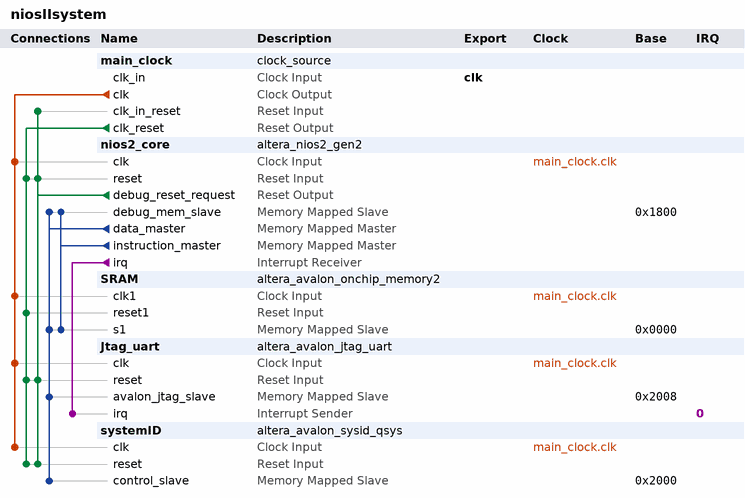
[diagram p0: system contents]
# Platform Designer (Qsys) system niosIIsystem, Cyclone V 5CEBA4F23C7
# Parameters at their usual value, and those the tool derives, are not listed.
package require -exact qsys 16.0
create_system niosIIsystem
set_project_property DEVICE_FAMILY {Cyclone V}
set_project_property DEVICE 5CEBA4F23C7

add_instance main_clock clock_source 16.0
set_instance_parameter_value main_clock clockFrequency 50000000

add_instance nios2_core altera_nios2_gen2 16.0
set_instance_parameter_value nios2_core dcache_size 2048
set_instance_parameter_value nios2_core exceptionSlave SRAM.s1
set_instance_parameter_value nios2_core icache_size 4096
set_instance_parameter_value nios2_core impl Fast
set_instance_parameter_value nios2_core resetSlave SRAM.s1

add_instance SRAM altera_avalon_onchip_memory2 16.0
set_instance_parameter_value SRAM dataWidth 32
set_instance_parameter_value SRAM dualPort false
set_instance_parameter_value SRAM initMemContent true
set_instance_parameter_value SRAM initializationFileName onchip_mem.hex
set_instance_parameter_value SRAM memorySize 4096

add_instance Jtag_uart altera_avalon_jtag_uart 16.0
set_instance_parameter_value Jtag_uart simInteractiveOptions NO_INTERACTIVE_WINDOWS

add_instance systemID altera_avalon_sysid_qsys 16.0
set_instance_parameter_value systemID id 1

# connections
add_connection main_clock.clk Jtag_uart.clk clock
add_connection main_clock.clk nios2_core.clk clock
add_connection main_clock.clk SRAM.clk1 clock
add_connection main_clock.clk systemID.clk clock
add_connection main_clock.clk_reset Jtag_uart.reset reset
add_connection main_clock.clk_reset nios2_core.reset reset
add_connection main_clock.clk_reset SRAM.reset1 reset
add_connection main_clock.clk_reset systemID.reset reset
add_connection nios2_core.debug_reset_request Jtag_uart.reset reset
add_connection nios2_core.debug_reset_request main_clock.clk_in_reset reset
add_connection nios2_core.debug_reset_request nios2_core.reset reset
add_connection nios2_core.debug_reset_request systemID.reset reset
add_connection nios2_core.data_master Jtag_uart.avalon_jtag_slave avalon
set_connection_parameter_value nios2_core.data_master/Jtag_uart.avalon_jtag_slave baseAddress 0x2008
add_connection nios2_core.data_master nios2_core.debug_mem_slave avalon
set_connection_parameter_value nios2_core.data_master/nios2_core.debug_mem_slave baseAddress 0x1800
add_connection nios2_core.data_master SRAM.s1 avalon
set_connection_parameter_value nios2_core.data_master/SRAM.s1 baseAddress 0x0000
add_connection nios2_core.data_master systemID.control_slave avalon
set_connection_parameter_value nios2_core.data_master/systemID.control_slave baseAddress 0x2000
add_connection nios2_core.instruction_master nios2_core.debug_mem_slave avalon
set_connection_parameter_value nios2_core.instruction_master/nios2_core.debug_mem_slave baseAddress 0x1800
add_connection nios2_core.instruction_master SRAM.s1 avalon
set_connection_parameter_value nios2_core.instruction_master/SRAM.s1 baseAddress 0x0000
add_connection nios2_core.irq Jtag_uart.irq interrupt
set_connection_parameter_value nios2_core.irq/Jtag_uart.irq irqNumber 0

# exported interfaces
add_interface clk clock sink
set_interface_property clk EXPORT_OF main_clock.clk_in

set_interconnect_requirement {$system} qsys_mm.clockCrossingAdapter HANDSHAKE
set_interconnect_requirement {$system} qsys_mm.enableEccProtection FALSE
set_interconnect_requirement {$system} qsys_mm.insertDefaultSlave FALSE
set_interconnect_requirement {$system} qsys_mm.maxAdditionalLatency 1

save_system niosIIsystem.qsys
